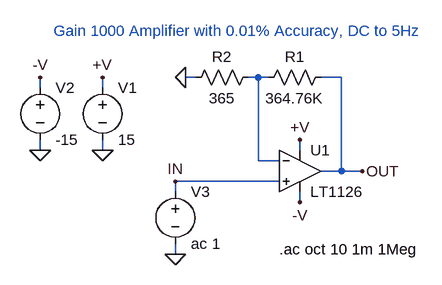
[diagram p0: schematic 1126.asc]
1126.asc, the LTspice schematic file:
Version 4
SHEET 1 896 680
WIRE 32 96 16 96
WIRE 128 96 112 96
WIRE 144 96 128 96
WIRE 256 96 224 96
WIRE -208 112 -208 96
WIRE -112 112 -112 96
WIRE -208 208 -208 192
WIRE -112 208 -112 192
WIRE 192 208 192 192
WIRE 128 224 128 96
WIRE 160 224 128 224
WIRE 256 240 256 96
WIRE 256 240 224 240
WIRE 288 240 256 240
WIRE 160 256 0 256
WIRE 0 272 0 256
WIRE 192 288 192 272
WIRE 0 368 0 352
FLAG -112 208 0
FLAG 192 192 +V
FLAG -112 96 +V
FLAG 192 288 -V
FLAG -208 208 0
FLAG -208 96 -V
FLAG 16 96 0
FLAG 0 368 0
FLAG 288 240 OUT
FLAG 0 256 IN
SYMBOL voltage -112 96 R0
SYMATTR InstName V1
SYMATTR Value 15
SYMBOL voltage -208 96 R0
SYMATTR InstName V2
SYMATTR Value -15
SYMBOL res 240 80 R90
WINDOW 0 0 56 VBottom 2
WINDOW 3 32 56 VTop 2
SYMATTR InstName R1
SYMATTR Value 364.76K
SYMBOL res 128 80 R90
WINDOW 0 0 56 VBottom 2
WINDOW 3 32 56 VTop 2
SYMATTR InstName R2
SYMATTR Value 365
SYMBOL voltage 0 256 R0
SYMATTR InstName V3
SYMATTR Value ac 1
SYMBOL opamps\\LT1126 192 176 R0
SYMATTR InstName U1
TEXT 160 360 Left 2 !.ac oct 10 1m 1Meg
TEXT 96 40 Bottom 2 ;Gain 1000 Amplifier with 0.01% Accuracy, DC to 5Hz

The netlist it stands for:
* 1126.asc
V1 +V 0 15
V2 -V 0 -15
R1 OUT N001 364.76K
R2 N001 0 365
V3 IN 0 ac 1
XU1 IN N001 +V -V OUT LT1126  ; pins In+ In- V+ V- OUT
.ac oct 10 1m 1Meg
* Gain 1000 Amplifier with 0.01% Accuracy, DC to 5Hz
.backanno
.end